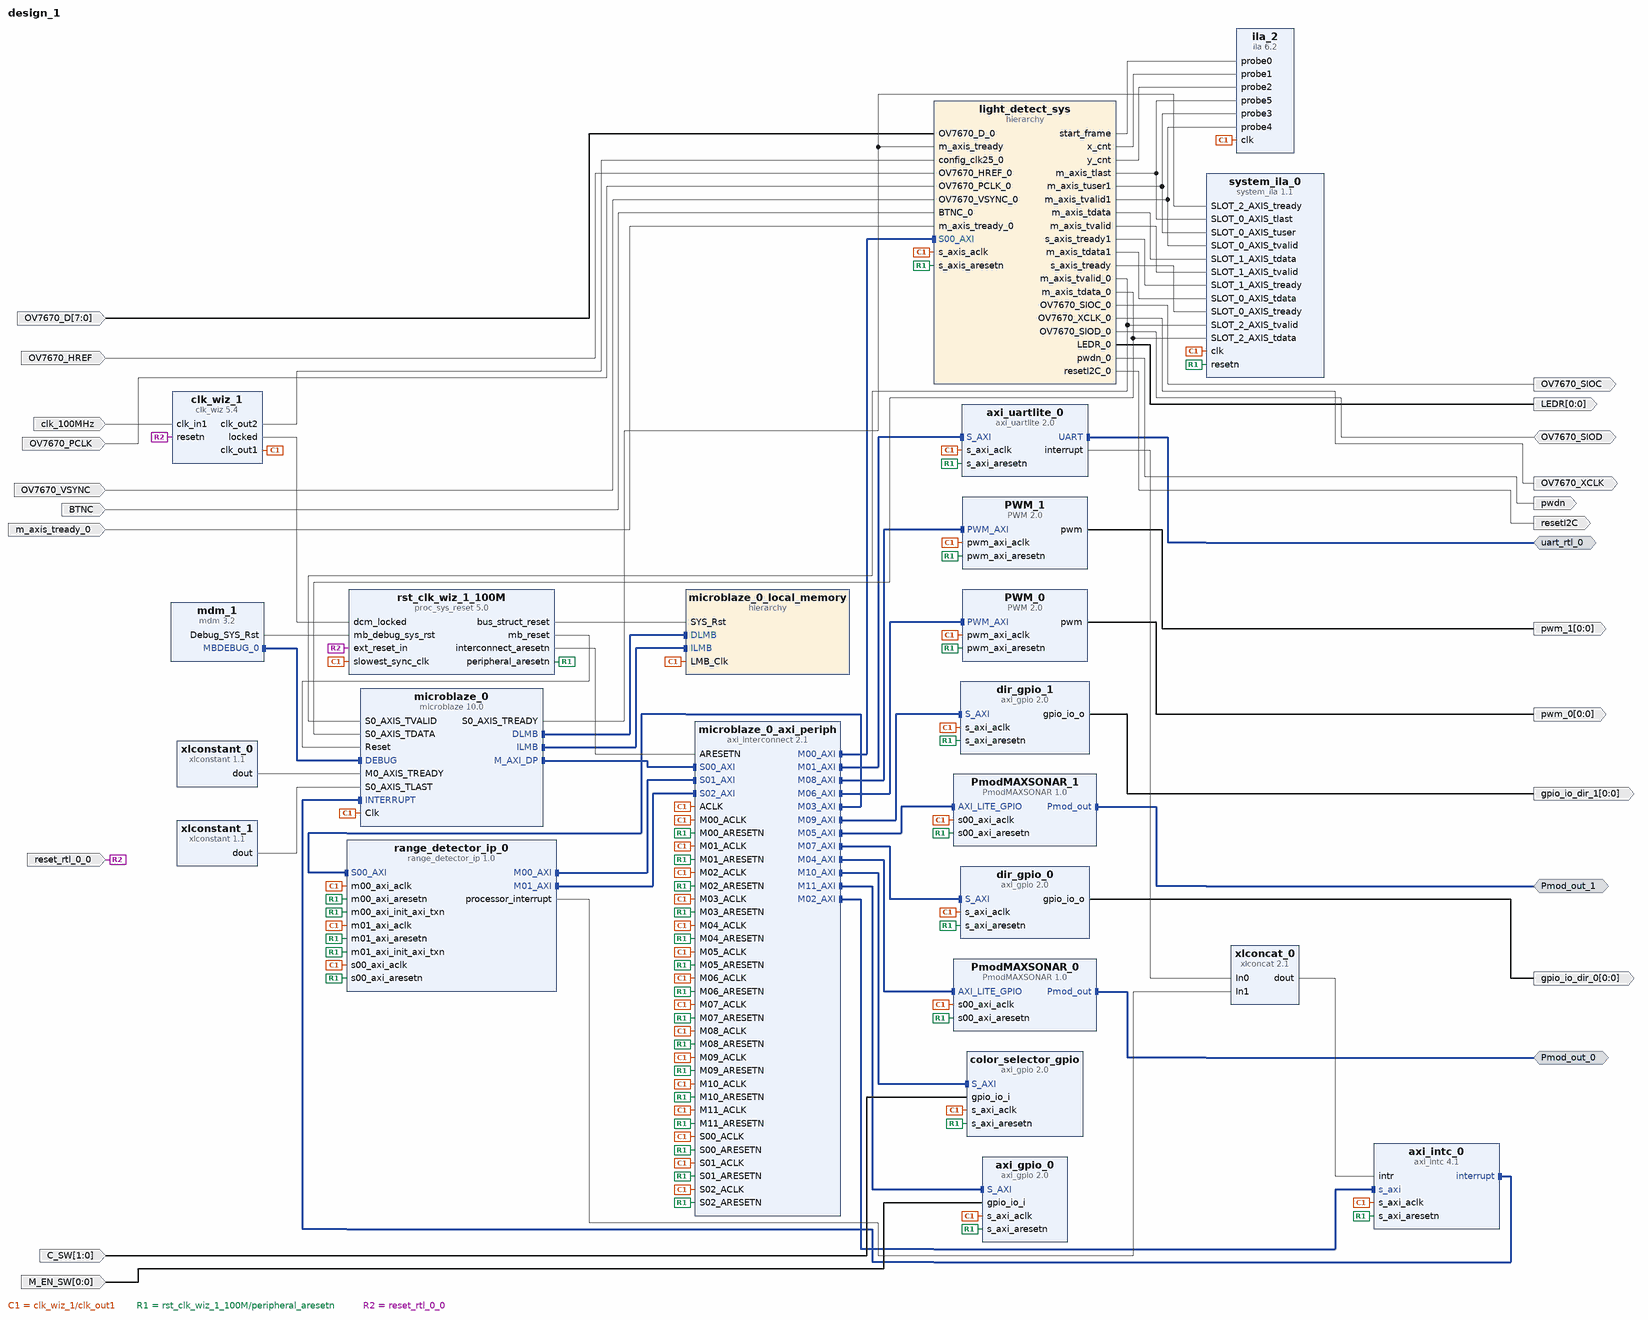
[diagram p0: block diagram of the top level]
# Vivado block design design_1, xc7a100tcsg324-1, Vivado 2017.4
create_bd_design design_1

create_bd_intf_port -mode Master -vlnv xilinx.com:interface:uart_rtl:1.0 uart_rtl_0
create_bd_intf_port -mode Master -vlnv digilentinc.com:interface:pmod_rtl:1.0 Pmod_out_0
create_bd_intf_port -mode Master -vlnv digilentinc.com:interface:pmod_rtl:1.0 Pmod_out_1
create_bd_port -dir I -type rst reset_rtl_0_0
set_property -dict {CONFIG.POLARITY ACTIVE_LOW} [get_bd_ports reset_rtl_0_0]
create_bd_port -dir I -from 7 -to 0 OV7670_D
create_bd_port -dir I OV7670_HREF
create_bd_port -dir I OV7670_PCLK
create_bd_port -dir I OV7670_VSYNC
create_bd_port -dir I BTNC
create_bd_port -dir O OV7670_XCLK
create_bd_port -dir O OV7670_SIOC
create_bd_port -dir IO OV7670_SIOD
create_bd_port -dir O pwdn
create_bd_port -dir O resetI2C
create_bd_port -dir O -from 0 -to 0 LEDR
create_bd_port -dir I -type clk clk_100MHz
set_property -dict {CONFIG.FREQ_HZ 100000000} [get_bd_ports clk_100MHz]
create_bd_port -dir I m_axis_tready_0
create_bd_port -dir O -from 0 -to 0 pwm_0
create_bd_port -dir O -from 0 -to 0 gpio_io_dir_0
create_bd_port -dir O -from 0 -to 0 pwm_1
create_bd_port -dir O -from 0 -to 0 gpio_io_dir_1
create_bd_port -dir I -from 1 -to 0 C_SW
create_bd_port -dir I -from 0 -to 0 M_EN_SW

create_bd_cell -type ip -vlnv xilinx.com:ip:microblaze:10.0 microblaze_0
set_property -dict [list \
  CONFIG.C_D_AXI 1 \
  CONFIG.C_D_LMB 1 \
  CONFIG.C_I_LMB 1 \
  CONFIG.C_USE_BARREL 1 \
  CONFIG.C_USE_DIV 1 \
  CONFIG.C_DEBUG_ENABLED 1 \
  CONFIG.C_FSL_LINKS 1 \
  CONFIG.C_USE_ICACHE 0 \
  CONFIG.C_ADDR_TAG_BITS 0 \
  CONFIG.C_USE_DCACHE 0 \
  CONFIG.C_DCACHE_ADDR_TAG 0 \
] [get_bd_cells microblaze_0]
create_bd_cell -type hier microblaze_0_local_memory
create_bd_cell -type ip -vlnv xilinx.com:ip:mdm:3.2 mdm_1
create_bd_cell -type ip -vlnv xilinx.com:ip:axi_interconnect:2.1 microblaze_0_axi_periph
set_property -dict {CONFIG.NUM_SI 3 CONFIG.NUM_MI 12} [get_bd_cells microblaze_0_axi_periph]
create_bd_cell -type hier light_detect_sys
create_bd_cell -type ip -vlnv xilinx.com:ip:xlconstant:1.1 xlconstant_0
create_bd_cell -type ip -vlnv xilinx.com:ip:xlconstant:1.1 xlconstant_1
set_property -dict {CONFIG.CONST_VAL 0} [get_bd_cells xlconstant_1]
create_bd_cell -type ip -vlnv xilinx.com:ip:system_ila:1.1 system_ila_0
set_property -dict [list \
  CONFIG.C_SLOT 0 \
  CONFIG.C_DATA_DEPTH 1024 \
  CONFIG.C_NUM_MONITOR_SLOTS 3 \
  CONFIG.C_SLOT_0_AXIS_TUSER_WIDTH 1 \
  CONFIG.C_SLOT_0_INTF_TYPE xilinx.com:interface:axis_rtl:1.0 \
  CONFIG.C_SLOT_1_INTF_TYPE xilinx.com:interface:axis_rtl:1.0 \
  CONFIG.C_SLOT_2_INTF_TYPE xilinx.com:interface:axis_rtl:1.0 \
] [get_bd_cells system_ila_0]
create_bd_cell -type ip -vlnv xilinx.com:ip:axi_intc:4.1 axi_intc_0
create_bd_cell -type ip -vlnv xilinx.com:ip:xlconcat:2.1 xlconcat_0
set_property -dict {CONFIG.NUM_PORTS 2} [get_bd_cells xlconcat_0]
create_bd_cell -type ip -vlnv xilinx.com:ip:axi_uartlite:2.0 axi_uartlite_0
create_bd_cell -type ip -vlnv xilinx.com:ip:clk_wiz:5.4 clk_wiz_1
set_property -dict [list \
  CONFIG.USE_INCLK_SWITCHOVER false \
  CONFIG.SECONDARY_IN_FREQ 100.000 \
  CONFIG.SECONDARY_SOURCE Single_ended_clock_capable_pin \
  CONFIG.CLKIN2_JITTER_PS 166.66 \
  CONFIG.CLKOUT2_USED true \
  CONFIG.NUM_OUT_CLKS 2 \
  CONFIG.CLKOUT2_REQUESTED_OUT_FREQ 25 \
  CONFIG.PRIM_SOURCE Single_ended_clock_capable_pin \
  CONFIG.RESET_PORT resetn \
  CONFIG.MMCM_DIVCLK_DIVIDE 1 \
  CONFIG.MMCM_CLKIN2_PERIOD 10.000 \
  CONFIG.MMCM_CLKOUT1_DIVIDE 40 \
  CONFIG.RESET_TYPE ACTIVE_LOW \
  CONFIG.CLKOUT2_JITTER 175.402 \
  CONFIG.CLKOUT2_PHASE_ERROR 98.575 \
] [get_bd_cells clk_wiz_1]
create_bd_cell -type ip -vlnv xilinx.com:ip:proc_sys_reset:5.0 rst_clk_wiz_1_100M
create_bd_cell -type ip -vlnv xilinx.com:ip:ila:6.2 ila_2
set_property -dict [list \
  CONFIG.C_PROBE2_WIDTH 12 \
  CONFIG.C_PROBE1_WIDTH 12 \
  CONFIG.C_DATA_DEPTH 8192 \
  CONFIG.C_NUM_OF_PROBES 6 \
  CONFIG.C_ENABLE_ILA_AXI_MON false \
  CONFIG.C_MONITOR_TYPE Native \
] [get_bd_cells ila_2]
create_bd_cell -type ip -vlnv digilentinc.com:IP:PmodMAXSONAR:1.0 PmodMAXSONAR_0
create_bd_cell -type ip -vlnv digilentinc.com:IP:PmodMAXSONAR:1.0 PmodMAXSONAR_1
create_bd_cell -type ip -vlnv digilentinc.com:IP:PWM:2.0 PWM_0
create_bd_cell -type ip -vlnv xilinx.com:ip:axi_gpio:2.0 dir_gpio_0
set_property -dict {CONFIG.C_GPIO_WIDTH 1 CONFIG.C_ALL_OUTPUTS 1} [get_bd_cells dir_gpio_0]
create_bd_cell -type ip -vlnv digilentinc.com:IP:PWM:2.0 PWM_1
create_bd_cell -type ip -vlnv xilinx.com:ip:axi_gpio:2.0 dir_gpio_1
set_property -dict {CONFIG.C_GPIO_WIDTH 1 CONFIG.C_ALL_OUTPUTS 1} [get_bd_cells dir_gpio_1]
create_bd_cell -type ip -vlnv user.org:user:range_detector_ip:1.0 range_detector_ip_0
create_bd_cell -type ip -vlnv xilinx.com:ip:axi_gpio:2.0 color_selector_gpio
set_property -dict {CONFIG.C_GPIO_WIDTH 2 CONFIG.C_ALL_INPUTS 1} [get_bd_cells color_selector_gpio]
create_bd_cell -type ip -vlnv xilinx.com:ip:axi_gpio:2.0 axi_gpio_0
set_property -dict {CONFIG.C_GPIO_WIDTH 1 CONFIG.C_ALL_INPUTS 1} [get_bd_cells axi_gpio_0]

# ---- hierarchy /microblaze_0_local_memory ----
current_bd_instance /microblaze_0_local_memory
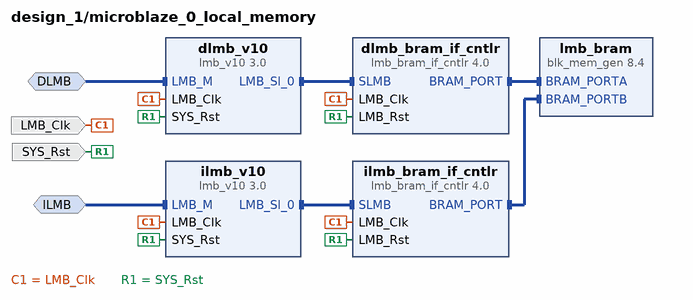
[diagram p1: block diagram inside /microblaze_0_local_memory]
create_bd_intf_pin -mode MirroredMaster -vlnv xilinx.com:interface:lmb_rtl:1.0 DLMB
create_bd_intf_pin -mode MirroredMaster -vlnv xilinx.com:interface:lmb_rtl:1.0 ILMB
create_bd_pin -dir I -type clk LMB_Clk
create_bd_pin -dir I -type rst SYS_Rst

create_bd_cell -type ip -vlnv xilinx.com:ip:lmb_v10:3.0 dlmb_v10
create_bd_cell -type ip -vlnv xilinx.com:ip:lmb_v10:3.0 ilmb_v10
create_bd_cell -type ip -vlnv xilinx.com:ip:lmb_bram_if_cntlr:4.0 dlmb_bram_if_cntlr
set_property -dict {CONFIG.C_ECC 0} [get_bd_cells dlmb_bram_if_cntlr]
create_bd_cell -type ip -vlnv xilinx.com:ip:lmb_bram_if_cntlr:4.0 ilmb_bram_if_cntlr
set_property -dict {CONFIG.C_ECC 0} [get_bd_cells ilmb_bram_if_cntlr]
create_bd_cell -type ip -vlnv xilinx.com:ip:blk_mem_gen:8.4 lmb_bram
set_property -dict {CONFIG.Memory_Type True_Dual_Port_RAM CONFIG.use_bram_block BRAM_Controller} [get_bd_cells lmb_bram]

# ---- hierarchy /light_detect_sys ----
current_bd_instance /light_detect_sys
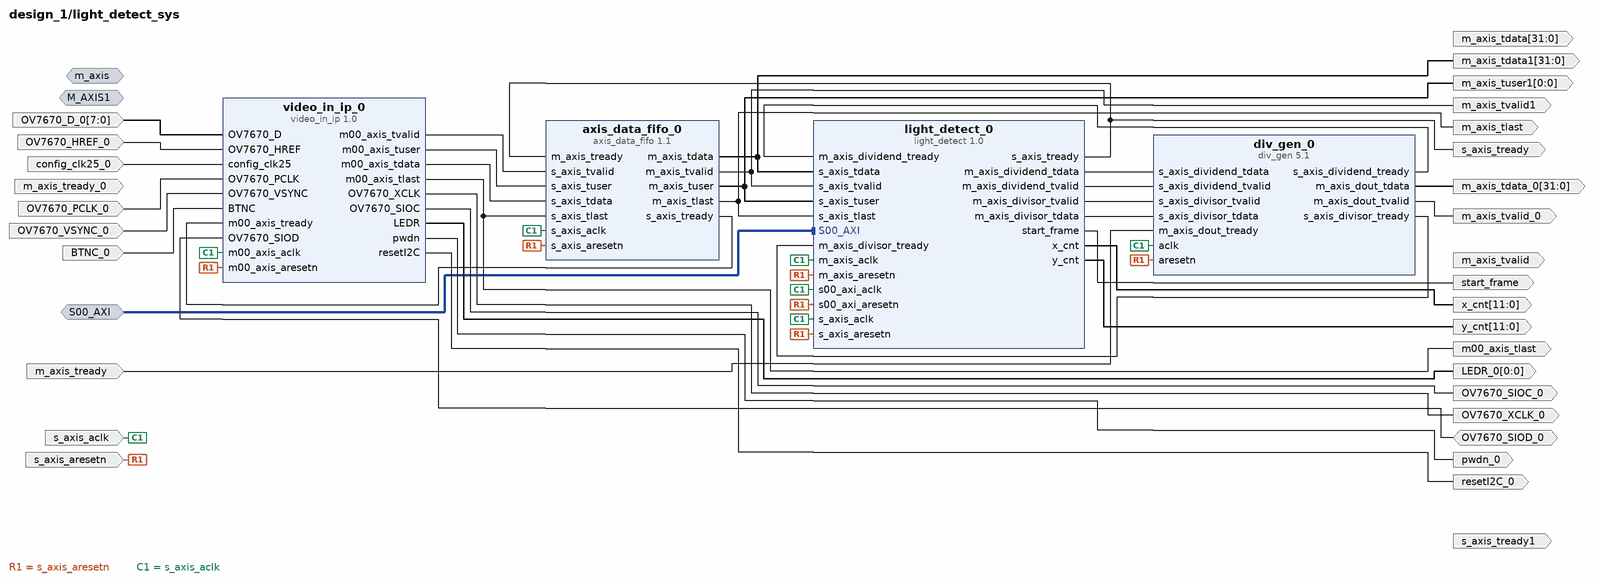
[diagram p2: block diagram inside /light_detect_sys]
create_bd_intf_pin -mode Slave -vlnv xilinx.com:interface:aximm_rtl:1.0 S00_AXI
create_bd_intf_pin -mode Monitor -vlnv xilinx.com:interface:axis_rtl:1.0 m_axis
create_bd_intf_pin -mode Monitor -vlnv xilinx.com:interface:axis_rtl:1.0 M_AXIS1
create_bd_pin -dir I -type rst s_axis_aresetn
create_bd_pin -dir I -type clk s_axis_aclk
create_bd_pin -dir I -from 7 -to 0 OV7670_D_0
create_bd_pin -dir I OV7670_HREF_0
create_bd_pin -dir I config_clk25_0
create_bd_pin -dir I OV7670_PCLK_0
create_bd_pin -dir I OV7670_VSYNC_0
create_bd_pin -dir I BTNC_0
create_bd_pin -dir O OV7670_XCLK_0
create_bd_pin -dir O OV7670_SIOC_0
create_bd_pin -dir IO OV7670_SIOD_0
create_bd_pin -dir O pwdn_0
create_bd_pin -dir O resetI2C_0
create_bd_pin -dir O -from 0 -to 0 LEDR_0
create_bd_pin -dir O -from 31 -to 0 m_axis_tdata1
create_bd_pin -dir O m_axis_tvalid1
create_bd_pin -dir O s_axis_tready
create_bd_pin -dir O m_axis_tvalid_0
create_bd_pin -dir I m_axis_tready_0
create_bd_pin -dir O -from 31 -to 0 m_axis_tdata_0
create_bd_pin -dir I m_axis_tready
create_bd_pin -dir O -from 31 -to 0 m_axis_tdata
create_bd_pin -dir O m_axis_tvalid
create_bd_pin -dir O s_axis_tready1
create_bd_pin -dir O m00_axis_tlast
create_bd_pin -dir O m_axis_tlast
create_bd_pin -dir O -from 0 -to 0 m_axis_tuser1
create_bd_pin -dir O start_frame
create_bd_pin -dir O -from 11 -to 0 x_cnt
create_bd_pin -dir O -from 11 -to 0 y_cnt

create_bd_cell -type ip -vlnv xilinx.com:ip:axis_data_fifo:1.1 axis_data_fifo_0
set_property -dict {CONFIG.TDATA_NUM_BYTES 4 CONFIG.TUSER_WIDTH 1 CONFIG.HAS_TLAST 1} [get_bd_cells axis_data_fifo_0]
create_bd_cell -type ip -vlnv xilinx.com:user:video_in_ip:1.0 video_in_ip_0
create_bd_cell -type ip -vlnv xilinx.com:ip:div_gen:5.1 div_gen_0
set_property -dict [list \
  CONFIG.algorithm_type High_Radix \
  CONFIG.dividend_and_quotient_width 32 \
  CONFIG.divisor_width 32 \
  CONFIG.remainder_type Fractional \
  CONFIG.fractional_width 0 \
  CONFIG.operand_sign Signed \
  CONFIG.clocks_per_division 1 \
  CONFIG.divide_by_zero_detect true \
  CONFIG.FlowControl Blocking \
  CONFIG.OutTready true \
  CONFIG.latency 29 \
  CONFIG.ARESETN true \
] [get_bd_cells div_gen_0]
create_bd_cell -type ip -vlnv user.org:user:light_detect:1.0 light_detect_0

# ---- connections ----

current_bd_instance /microblaze_0_local_memory
connect_bd_intf_net -intf_net microblaze_0_dlmb_bus [get_bd_intf_pins dlmb_v10/LMB_Sl_0] [get_bd_intf_pins dlmb_bram_if_cntlr/SLMB]
connect_bd_intf_net -intf_net microblaze_0_ilmb_bus [get_bd_intf_pins ilmb_v10/LMB_Sl_0] [get_bd_intf_pins ilmb_bram_if_cntlr/SLMB]
connect_bd_intf_net -intf_net microblaze_0_dlmb_cntlr [get_bd_intf_pins dlmb_bram_if_cntlr/BRAM_PORT] [get_bd_intf_pins lmb_bram/BRAM_PORTA]
connect_bd_intf_net -intf_net microblaze_0_ilmb_cntlr [get_bd_intf_pins ilmb_bram_if_cntlr/BRAM_PORT] [get_bd_intf_pins lmb_bram/BRAM_PORTB]
connect_bd_intf_net -intf_net microblaze_0_dlmb [get_bd_intf_pins DLMB] [get_bd_intf_pins dlmb_v10/LMB_M]
connect_bd_intf_net -intf_net microblaze_0_ilmb [get_bd_intf_pins ILMB] [get_bd_intf_pins ilmb_v10/LMB_M]
connect_bd_net -net microblaze_0_Clk [get_bd_pins LMB_Clk] \
  [get_bd_pins dlmb_v10/LMB_Clk] [get_bd_pins dlmb_bram_if_cntlr/LMB_Clk] [get_bd_pins ilmb_v10/LMB_Clk] \
  [get_bd_pins ilmb_bram_if_cntlr/LMB_Clk]
connect_bd_net [get_bd_pins SYS_Rst] \
  [get_bd_pins dlmb_v10/SYS_Rst] [get_bd_pins dlmb_bram_if_cntlr/LMB_Rst] [get_bd_pins ilmb_v10/SYS_Rst] \
  [get_bd_pins ilmb_bram_if_cntlr/LMB_Rst]

current_bd_instance /light_detect_sys
connect_bd_intf_net [get_bd_intf_pins S00_AXI] [get_bd_intf_pins light_detect_0/S00_AXI]
# interface net Conn2 has one end: m_axis
# interface net Conn3 has one end: M_AXIS1
connect_bd_net -net rst_clk_wiz_1_100M_peripheral_aresetn [get_bd_pins s_axis_aresetn] \
  [get_bd_pins axis_data_fifo_0/s_axis_aresetn] [get_bd_pins video_in_ip_0/m00_axis_aresetn] [get_bd_pins div_gen_0/aresetn] \
  [get_bd_pins light_detect_0/s_axis_aresetn] [get_bd_pins light_detect_0/m_axis_aresetn] \
  [get_bd_pins light_detect_0/s00_axi_aresetn]
connect_bd_net -net microblaze_0_Clk [get_bd_pins s_axis_aclk] \
  [get_bd_pins axis_data_fifo_0/s_axis_aclk] [get_bd_pins video_in_ip_0/m00_axis_aclk] [get_bd_pins div_gen_0/aclk] \
  [get_bd_pins light_detect_0/s_axis_aclk] [get_bd_pins light_detect_0/m_axis_aclk] [get_bd_pins light_detect_0/s00_axi_aclk]
connect_bd_net -net OV7670_D_0_1 [get_bd_pins OV7670_D_0] [get_bd_pins video_in_ip_0/OV7670_D]
connect_bd_net -net OV7670_HREF_0_1 [get_bd_pins OV7670_HREF_0] [get_bd_pins video_in_ip_0/OV7670_HREF]
connect_bd_net -net config_clk25_0_1 [get_bd_pins config_clk25_0] [get_bd_pins video_in_ip_0/config_clk25]
connect_bd_net -net OV7670_PCLK_0_1 [get_bd_pins OV7670_PCLK_0] [get_bd_pins video_in_ip_0/OV7670_PCLK]
connect_bd_net -net OV7670_VSYNC_0_1 [get_bd_pins OV7670_VSYNC_0] [get_bd_pins video_in_ip_0/OV7670_VSYNC]
connect_bd_net -net BTNC_0_1 [get_bd_pins BTNC_0] [get_bd_pins video_in_ip_0/BTNC]
connect_bd_net -net video_in_ip_v1_0_0_m00_axis_tlast [get_bd_pins video_in_ip_0/m00_axis_tlast] \
  [get_bd_pins m00_axis_tlast] [get_bd_pins axis_data_fifo_0/s_axis_tlast]
connect_bd_net [get_bd_pins axis_data_fifo_0/m_axis_tdata] [get_bd_pins m_axis_tdata1] [get_bd_pins light_detect_0/s_axis_tdata]
connect_bd_net [get_bd_pins axis_data_fifo_0/m_axis_tvalid] [get_bd_pins m_axis_tvalid1] [get_bd_pins light_detect_0/s_axis_tvalid]
connect_bd_net [get_bd_pins light_detect_0/s_axis_tready] [get_bd_pins s_axis_tready] [get_bd_pins axis_data_fifo_0/m_axis_tready]
connect_bd_net [get_bd_pins axis_data_fifo_0/m_axis_tuser] [get_bd_pins m_axis_tuser1] [get_bd_pins light_detect_0/s_axis_tuser]
connect_bd_net [get_bd_pins m_axis_tready] [get_bd_pins div_gen_0/m_axis_dout_tready]
connect_bd_net [get_bd_pins axis_data_fifo_0/m_axis_tlast] [get_bd_pins m_axis_tlast] [get_bd_pins light_detect_0/s_axis_tlast]
connect_bd_net [get_bd_pins light_detect_0/start_frame] [get_bd_pins start_frame]
connect_bd_net [get_bd_pins light_detect_0/x_cnt] [get_bd_pins x_cnt]
connect_bd_net [get_bd_pins light_detect_0/y_cnt] [get_bd_pins y_cnt]
connect_bd_net [get_bd_pins video_in_ip_0/OV7670_XCLK] [get_bd_pins OV7670_XCLK_0]
connect_bd_net [get_bd_pins video_in_ip_0/OV7670_SIOC] [get_bd_pins OV7670_SIOC_0]
connect_bd_net [get_bd_pins OV7670_SIOD_0] [get_bd_pins video_in_ip_0/OV7670_SIOD]
connect_bd_net [get_bd_pins video_in_ip_0/pwdn] [get_bd_pins pwdn_0]
connect_bd_net [get_bd_pins video_in_ip_0/resetI2C] [get_bd_pins resetI2C_0]
connect_bd_net [get_bd_pins video_in_ip_0/LEDR] [get_bd_pins LEDR_0]
connect_bd_net [get_bd_pins video_in_ip_0/m00_axis_tvalid] [get_bd_pins axis_data_fifo_0/s_axis_tvalid]
connect_bd_net [get_bd_pins axis_data_fifo_0/s_axis_tready] [get_bd_pins video_in_ip_0/m00_axis_tready]
connect_bd_net [get_bd_pins video_in_ip_0/m00_axis_tuser] [get_bd_pins axis_data_fifo_0/s_axis_tuser]
connect_bd_net [get_bd_pins video_in_ip_0/m00_axis_tdata] [get_bd_pins axis_data_fifo_0/s_axis_tdata]
connect_bd_net [get_bd_pins light_detect_0/m_axis_dividend_tdata] [get_bd_pins div_gen_0/s_axis_dividend_tdata]
connect_bd_net [get_bd_pins light_detect_0/m_axis_dividend_tvalid] [get_bd_pins div_gen_0/s_axis_dividend_tvalid]
connect_bd_net [get_bd_pins div_gen_0/s_axis_dividend_tready] [get_bd_pins light_detect_0/m_axis_dividend_tready]
connect_bd_net [get_bd_pins light_detect_0/m_axis_divisor_tvalid] [get_bd_pins div_gen_0/s_axis_divisor_tvalid]
connect_bd_net [get_bd_pins div_gen_0/s_axis_divisor_tready] [get_bd_pins light_detect_0/m_axis_divisor_tready]
connect_bd_net [get_bd_pins light_detect_0/m_axis_divisor_tdata] [get_bd_pins div_gen_0/s_axis_divisor_tdata]
connect_bd_net [get_bd_pins div_gen_0/m_axis_dout_tdata] [get_bd_pins m_axis_tdata_0]
connect_bd_net [get_bd_pins div_gen_0/m_axis_dout_tvalid] [get_bd_pins m_axis_tvalid_0]

current_bd_instance /
connect_bd_intf_net [get_bd_intf_pins microblaze_0/DLMB] [get_bd_intf_pins microblaze_0_local_memory/DLMB]
connect_bd_intf_net [get_bd_intf_pins microblaze_0/ILMB] [get_bd_intf_pins microblaze_0_local_memory/ILMB]
connect_bd_intf_net [get_bd_intf_pins mdm_1/MBDEBUG_0] [get_bd_intf_pins microblaze_0/DEBUG]
connect_bd_intf_net [get_bd_intf_pins microblaze_0/M_AXI_DP] [get_bd_intf_pins microblaze_0_axi_periph/S00_AXI]
connect_bd_intf_net [get_bd_intf_pins microblaze_0_axi_periph/M00_AXI] [get_bd_intf_pins light_detect_sys/S00_AXI]
connect_bd_intf_net [get_bd_intf_pins microblaze_0_axi_periph/M01_AXI] [get_bd_intf_pins axi_uartlite_0/S_AXI]
connect_bd_intf_net [get_bd_intf_pins microblaze_0_axi_periph/M02_AXI] [get_bd_intf_pins axi_intc_0/s_axi]
connect_bd_intf_net [get_bd_intf_pins axi_intc_0/interrupt] [get_bd_intf_pins microblaze_0/INTERRUPT]
connect_bd_intf_net [get_bd_intf_pins microblaze_0_axi_periph/M03_AXI] [get_bd_intf_pins range_detector_ip_0/S00_AXI]
connect_bd_intf_net [get_bd_intf_pins range_detector_ip_0/M00_AXI] [get_bd_intf_pins microblaze_0_axi_periph/S01_AXI]
connect_bd_intf_net [get_bd_intf_pins range_detector_ip_0/M01_AXI] [get_bd_intf_pins microblaze_0_axi_periph/S02_AXI]
connect_bd_intf_net [get_bd_intf_pins microblaze_0_axi_periph/M04_AXI] [get_bd_intf_pins PmodMAXSONAR_0/AXI_LITE_GPIO]
connect_bd_intf_net [get_bd_intf_pins microblaze_0_axi_periph/M05_AXI] [get_bd_intf_pins PmodMAXSONAR_1/AXI_LITE_GPIO]
connect_bd_intf_net [get_bd_intf_pins microblaze_0_axi_periph/M06_AXI] [get_bd_intf_pins PWM_0/PWM_AXI]
connect_bd_intf_net [get_bd_intf_pins microblaze_0_axi_periph/M07_AXI] [get_bd_intf_pins dir_gpio_0/S_AXI]
connect_bd_intf_net [get_bd_intf_pins microblaze_0_axi_periph/M08_AXI] [get_bd_intf_pins PWM_1/PWM_AXI]
connect_bd_intf_net [get_bd_intf_pins microblaze_0_axi_periph/M09_AXI] [get_bd_intf_pins dir_gpio_1/S_AXI]
connect_bd_intf_net [get_bd_intf_pins microblaze_0_axi_periph/M10_AXI] [get_bd_intf_pins color_selector_gpio/S_AXI]
connect_bd_intf_net [get_bd_intf_pins microblaze_0_axi_periph/M11_AXI] [get_bd_intf_pins axi_gpio_0/S_AXI]
connect_bd_intf_net [get_bd_intf_ports uart_rtl_0] [get_bd_intf_pins axi_uartlite_0/UART]
connect_bd_intf_net [get_bd_intf_ports Pmod_out_0] [get_bd_intf_pins PmodMAXSONAR_0/Pmod_out]
connect_bd_intf_net [get_bd_intf_ports Pmod_out_1] [get_bd_intf_pins PmodMAXSONAR_1/Pmod_out]
connect_bd_net -net microblaze_0_Clk [get_bd_pins clk_wiz_1/clk_out1] \
  [get_bd_pins microblaze_0/Clk] [get_bd_pins system_ila_0/clk] [get_bd_pins axi_intc_0/s_axi_aclk] \
  [get_bd_pins axi_uartlite_0/s_axi_aclk] [get_bd_pins rst_clk_wiz_1_100M/slowest_sync_clk] [get_bd_pins ila_2/clk] \
  [get_bd_pins PmodMAXSONAR_0/s00_axi_aclk] [get_bd_pins PmodMAXSONAR_1/s00_axi_aclk] [get_bd_pins PWM_0/pwm_axi_aclk] \
  [get_bd_pins dir_gpio_0/s_axi_aclk] [get_bd_pins PWM_1/pwm_axi_aclk] [get_bd_pins dir_gpio_1/s_axi_aclk] \
  [get_bd_pins range_detector_ip_0/s00_axi_aclk] [get_bd_pins range_detector_ip_0/m00_axi_aclk] \
  [get_bd_pins range_detector_ip_0/m01_axi_aclk] [get_bd_pins microblaze_0_local_memory/LMB_Clk] \
  [get_bd_pins microblaze_0_axi_periph/S00_ACLK] [get_bd_pins microblaze_0_axi_periph/M00_ACLK] \
  [get_bd_pins microblaze_0_axi_periph/ACLK] [get_bd_pins light_detect_sys/s_axis_aclk] \
  [get_bd_pins microblaze_0_axi_periph/M01_ACLK] [get_bd_pins microblaze_0_axi_periph/M02_ACLK] \
  [get_bd_pins microblaze_0_axi_periph/M03_ACLK] [get_bd_pins microblaze_0_axi_periph/S01_ACLK] \
  [get_bd_pins microblaze_0_axi_periph/S02_ACLK] [get_bd_pins microblaze_0_axi_periph/M04_ACLK] \
  [get_bd_pins microblaze_0_axi_periph/M05_ACLK] [get_bd_pins microblaze_0_axi_periph/M06_ACLK] \
  [get_bd_pins microblaze_0_axi_periph/M07_ACLK] [get_bd_pins microblaze_0_axi_periph/M08_ACLK] \
  [get_bd_pins microblaze_0_axi_periph/M09_ACLK] [get_bd_pins color_selector_gpio/s_axi_aclk] \
  [get_bd_pins microblaze_0_axi_periph/M10_ACLK] [get_bd_pins axi_gpio_0/s_axi_aclk] \
  [get_bd_pins microblaze_0_axi_periph/M11_ACLK]
connect_bd_net [get_bd_pins clk_wiz_1/locked] [get_bd_pins rst_clk_wiz_1_100M/dcm_locked]
connect_bd_net [get_bd_pins rst_clk_wiz_1_100M/mb_reset] [get_bd_pins microblaze_0/Reset]
connect_bd_net [get_bd_pins rst_clk_wiz_1_100M/bus_struct_reset] [get_bd_pins microblaze_0_local_memory/SYS_Rst]
connect_bd_net [get_bd_pins mdm_1/Debug_SYS_Rst] [get_bd_pins rst_clk_wiz_1_100M/mb_debug_sys_rst]
connect_bd_net [get_bd_pins rst_clk_wiz_1_100M/peripheral_aresetn] \
  [get_bd_pins system_ila_0/resetn] [get_bd_pins axi_intc_0/s_axi_aresetn] [get_bd_pins axi_uartlite_0/s_axi_aresetn] \
  [get_bd_pins PmodMAXSONAR_0/s00_axi_aresetn] [get_bd_pins PmodMAXSONAR_1/s00_axi_aresetn] \
  [get_bd_pins PWM_0/pwm_axi_aresetn] [get_bd_pins dir_gpio_0/s_axi_aresetn] [get_bd_pins PWM_1/pwm_axi_aresetn] \
  [get_bd_pins dir_gpio_1/s_axi_aresetn] [get_bd_pins range_detector_ip_0/s00_axi_aresetn] \
  [get_bd_pins range_detector_ip_0/m00_axi_aresetn] [get_bd_pins range_detector_ip_0/m00_axi_init_axi_txn] \
  [get_bd_pins range_detector_ip_0/m01_axi_aresetn] [get_bd_pins range_detector_ip_0/m01_axi_init_axi_txn] \
  [get_bd_pins microblaze_0_axi_periph/S00_ARESETN] [get_bd_pins microblaze_0_axi_periph/M00_ARESETN] \
  [get_bd_pins light_detect_sys/s_axis_aresetn] [get_bd_pins microblaze_0_axi_periph/M01_ARESETN] \
  [get_bd_pins microblaze_0_axi_periph/M02_ARESETN] [get_bd_pins microblaze_0_axi_periph/M03_ARESETN] \
  [get_bd_pins microblaze_0_axi_periph/S01_ARESETN] [get_bd_pins microblaze_0_axi_periph/S02_ARESETN] \
  [get_bd_pins microblaze_0_axi_periph/M04_ARESETN] [get_bd_pins microblaze_0_axi_periph/M05_ARESETN] \
  [get_bd_pins microblaze_0_axi_periph/M06_ARESETN] [get_bd_pins microblaze_0_axi_periph/M07_ARESETN] \
  [get_bd_pins microblaze_0_axi_periph/M08_ARESETN] [get_bd_pins microblaze_0_axi_periph/M09_ARESETN] \
  [get_bd_pins color_selector_gpio/s_axi_aresetn] [get_bd_pins microblaze_0_axi_periph/M10_ARESETN] \
  [get_bd_pins axi_gpio_0/s_axi_aresetn] [get_bd_pins microblaze_0_axi_periph/M11_ARESETN]
connect_bd_net [get_bd_pins rst_clk_wiz_1_100M/interconnect_aresetn] [get_bd_pins microblaze_0_axi_periph/ARESETN]
connect_bd_net -net reset_rtl_0_0_1 [get_bd_ports reset_rtl_0_0] [get_bd_pins clk_wiz_1/resetn] [get_bd_pins rst_clk_wiz_1_100M/ext_reset_in]
connect_bd_net -net OV7670_D_0_1 [get_bd_ports OV7670_D] [get_bd_pins light_detect_sys/OV7670_D_0]
connect_bd_net -net OV7670_HREF_0_1 [get_bd_ports OV7670_HREF] [get_bd_pins light_detect_sys/OV7670_HREF_0]
connect_bd_net -net OV7670_PCLK_0_1 [get_bd_ports OV7670_PCLK] [get_bd_pins light_detect_sys/OV7670_PCLK_0]
connect_bd_net -net OV7670_VSYNC_0_1 [get_bd_ports OV7670_VSYNC] [get_bd_pins light_detect_sys/OV7670_VSYNC_0]
connect_bd_net -net BTNC_0_1 [get_bd_ports BTNC] [get_bd_pins light_detect_sys/BTNC_0]
connect_bd_net [get_bd_pins light_detect_sys/OV7670_XCLK_0] [get_bd_ports OV7670_XCLK]
connect_bd_net [get_bd_pins light_detect_sys/OV7670_SIOC_0] [get_bd_ports OV7670_SIOC]
connect_bd_net [get_bd_ports OV7670_SIOD] [get_bd_pins light_detect_sys/OV7670_SIOD_0]
connect_bd_net [get_bd_pins light_detect_sys/pwdn_0] [get_bd_ports pwdn]
connect_bd_net [get_bd_pins light_detect_sys/resetI2C_0] [get_bd_ports resetI2C]
connect_bd_net [get_bd_pins light_detect_sys/LEDR_0] [get_bd_ports LEDR]
connect_bd_net [get_bd_ports clk_100MHz] [get_bd_pins clk_wiz_1/clk_in1]
connect_bd_net -net config_clk25_0_1 [get_bd_pins clk_wiz_1/clk_out2] [get_bd_pins light_detect_sys/config_clk25_0]
connect_bd_net [get_bd_pins xlconstant_0/dout] [get_bd_pins microblaze_0/M0_AXIS_TREADY]
connect_bd_net [get_bd_pins light_detect_sys/m_axis_tvalid_0] [get_bd_pins microblaze_0/S0_AXIS_TVALID] [get_bd_pins system_ila_0/SLOT_2_AXIS_tvalid]
connect_bd_net -net m_axis_tready_0_1 [get_bd_ports m_axis_tready_0] [get_bd_pins light_detect_sys/m_axis_tready_0]
connect_bd_net [get_bd_pins microblaze_0/S0_AXIS_TREADY] [get_bd_pins system_ila_0/SLOT_2_AXIS_tready] [get_bd_pins light_detect_sys/m_axis_tready]
connect_bd_net [get_bd_pins xlconstant_1/dout] [get_bd_pins microblaze_0/S0_AXIS_TLAST]
connect_bd_net [get_bd_pins light_detect_sys/m_axis_tdata] [get_bd_pins system_ila_0/SLOT_1_AXIS_tdata]
connect_bd_net [get_bd_pins light_detect_sys/m_axis_tvalid] [get_bd_pins system_ila_0/SLOT_1_AXIS_tvalid]
connect_bd_net [get_bd_pins light_detect_sys/s_axis_tready1] [get_bd_pins system_ila_0/SLOT_1_AXIS_tready]
connect_bd_net [get_bd_pins light_detect_sys/m_axis_tdata_0] [get_bd_pins microblaze_0/S0_AXIS_TDATA] [get_bd_pins system_ila_0/SLOT_2_AXIS_tdata]
connect_bd_net [get_bd_pins xlconcat_0/dout] [get_bd_pins axi_intc_0/intr]
connect_bd_net [get_bd_pins axi_uartlite_0/interrupt] [get_bd_pins xlconcat_0/In0]
connect_bd_net [get_bd_pins range_detector_ip_0/processor_interrupt] [get_bd_pins xlconcat_0/In1]
connect_bd_net [get_bd_pins light_detect_sys/m_axis_tdata1] [get_bd_pins system_ila_0/SLOT_0_AXIS_tdata]
connect_bd_net [get_bd_pins light_detect_sys/m_axis_tlast] [get_bd_pins system_ila_0/SLOT_0_AXIS_tlast] [get_bd_pins ila_2/probe5]
connect_bd_net [get_bd_pins light_detect_sys/m_axis_tuser1] [get_bd_pins system_ila_0/SLOT_0_AXIS_tuser] [get_bd_pins ila_2/probe3]
connect_bd_net [get_bd_pins light_detect_sys/m_axis_tvalid1] [get_bd_pins system_ila_0/SLOT_0_AXIS_tvalid] [get_bd_pins ila_2/probe4]
connect_bd_net [get_bd_pins light_detect_sys/s_axis_tready] [get_bd_pins system_ila_0/SLOT_0_AXIS_tready]
connect_bd_net [get_bd_pins light_detect_sys/start_frame] [get_bd_pins ila_2/probe0]
connect_bd_net [get_bd_pins light_detect_sys/x_cnt] [get_bd_pins ila_2/probe1]
connect_bd_net [get_bd_pins light_detect_sys/y_cnt] [get_bd_pins ila_2/probe2]
connect_bd_net [get_bd_pins PWM_0/pwm] [get_bd_ports pwm_0]
connect_bd_net [get_bd_pins dir_gpio_0/gpio_io_o] [get_bd_ports gpio_io_dir_0]
connect_bd_net [get_bd_pins PWM_1/pwm] [get_bd_ports pwm_1]
connect_bd_net [get_bd_pins dir_gpio_1/gpio_io_o] [get_bd_ports gpio_io_dir_1]
connect_bd_net -net gpio_io_i_0_1 [get_bd_ports C_SW] [get_bd_pins color_selector_gpio/gpio_io_i]
connect_bd_net -net gpio_io_i_0_2 [get_bd_ports M_EN_SW] [get_bd_pins axi_gpio_0/gpio_io_i]

# ---- address map ----
assign_bd_address -offset 0x00000000 -range 256K -target_address_space [get_bd_addr_spaces microblaze_0/Data] [get_bd_addr_segs microblaze_0_local_memory/dlmb_bram_if_cntlr/SLMB/Mem]
assign_bd_address -offset 0x00040000 -range 4K -target_address_space [get_bd_addr_spaces microblaze_0/Data] [get_bd_addr_segs PmodMAXSONAR_0/AXI_LITE_GPIO/Reg0]
assign_bd_address -offset 0x00050000 -range 4K -target_address_space [get_bd_addr_spaces microblaze_0/Data] [get_bd_addr_segs PmodMAXSONAR_1/AXI_LITE_GPIO/Reg0]
assign_bd_address -offset 0x40000000 -range 64K -target_address_space [get_bd_addr_spaces microblaze_0/Data] [get_bd_addr_segs dir_gpio_0/S_AXI/Reg]
assign_bd_address -offset 0x40010000 -range 64K -target_address_space [get_bd_addr_spaces microblaze_0/Data] [get_bd_addr_segs dir_gpio_1/S_AXI/Reg]
assign_bd_address -offset 0x40020000 -range 64K -target_address_space [get_bd_addr_spaces microblaze_0/Data] [get_bd_addr_segs color_selector_gpio/S_AXI/Reg]
assign_bd_address -offset 0x40030000 -range 64K -target_address_space [get_bd_addr_spaces microblaze_0/Data] [get_bd_addr_segs axi_gpio_0/S_AXI/Reg]
assign_bd_address -offset 0x40600000 -range 64K -target_address_space [get_bd_addr_spaces microblaze_0/Data] [get_bd_addr_segs axi_uartlite_0/S_AXI/Reg]
assign_bd_address -offset 0x41200000 -range 64K -target_address_space [get_bd_addr_spaces microblaze_0/Data] [get_bd_addr_segs axi_intc_0/S_AXI/Reg]
assign_bd_address -offset 0x44A00000 -range 64K -target_address_space [get_bd_addr_spaces microblaze_0/Data] [get_bd_addr_segs light_detect_sys/light_detect_0/S00_AXI/S00_AXI_reg]
assign_bd_address -offset 0x44A10000 -range 64K -target_address_space [get_bd_addr_spaces microblaze_0/Data] [get_bd_addr_segs range_detector_ip_0/S00_AXI/S00_AXI_reg]
assign_bd_address -offset 0x44A20000 -range 64K -target_address_space [get_bd_addr_spaces microblaze_0/Data] [get_bd_addr_segs PWM_0/PWM_AXI/PWM_AXI_reg]
assign_bd_address -offset 0x44A30000 -range 64K -target_address_space [get_bd_addr_spaces microblaze_0/Data] [get_bd_addr_segs PWM_1/PWM_AXI/PWM_AXI_reg]
assign_bd_address -offset 0x00000000 -range 64K -target_address_space [get_bd_addr_spaces microblaze_0/Instruction] [get_bd_addr_segs microblaze_0_local_memory/ilmb_bram_if_cntlr/SLMB/Mem]
assign_bd_address -offset 0x00040000 -range 4K -target_address_space [get_bd_addr_spaces range_detector_ip_0/M00_AXI] [get_bd_addr_segs PmodMAXSONAR_0/AXI_LITE_GPIO/Reg0]
assign_bd_address -offset 0x40000000 -range 64K -target_address_space [get_bd_addr_spaces range_detector_ip_0/M00_AXI] [get_bd_addr_segs dir_gpio_0/S_AXI/Reg]
assign_bd_address -offset 0x40010000 -range 64K -target_address_space [get_bd_addr_spaces range_detector_ip_0/M00_AXI] [get_bd_addr_segs dir_gpio_1/S_AXI/Reg]
assign_bd_address -offset 0x40020000 -range 64K -target_address_space [get_bd_addr_spaces range_detector_ip_0/M00_AXI] [get_bd_addr_segs color_selector_gpio/S_AXI/Reg]
assign_bd_address -offset 0x40030000 -range 64K -target_address_space [get_bd_addr_spaces range_detector_ip_0/M00_AXI] [get_bd_addr_segs axi_gpio_0/S_AXI/Reg]
assign_bd_address -offset 0x44A20000 -range 64K -target_address_space [get_bd_addr_spaces range_detector_ip_0/M00_AXI] [get_bd_addr_segs PWM_0/PWM_AXI/PWM_AXI_reg]
assign_bd_address -offset 0x44A30000 -range 64K -target_address_space [get_bd_addr_spaces range_detector_ip_0/M00_AXI] [get_bd_addr_segs PWM_1/PWM_AXI/PWM_AXI_reg]
exclude_bd_addr_seg -offset 0x40600000 -range 64K -target_address_space [get_bd_addr_spaces range_detector_ip_0/M00_AXI] [get_bd_addr_segs axi_uartlite_0/S_AXI/Reg]
exclude_bd_addr_seg -offset 0x41200000 -range 64K -target_address_space [get_bd_addr_spaces range_detector_ip_0/M00_AXI] [get_bd_addr_segs axi_intc_0/S_AXI/Reg]
exclude_bd_addr_seg -offset 0x44A00000 -range 64K -target_address_space [get_bd_addr_spaces range_detector_ip_0/M00_AXI] [get_bd_addr_segs light_detect_sys/light_detect_0/S00_AXI/S00_AXI_reg]
exclude_bd_addr_seg -offset 0x44A10000 -range 64K -target_address_space [get_bd_addr_spaces range_detector_ip_0/M00_AXI] [get_bd_addr_segs range_detector_ip_0/S00_AXI/S00_AXI_reg]
assign_bd_address -offset 0x00050000 -range 4K -target_address_space [get_bd_addr_spaces range_detector_ip_0/M01_AXI] [get_bd_addr_segs PmodMAXSONAR_1/AXI_LITE_GPIO/Reg0]
assign_bd_address -offset 0x40000000 -range 64K -target_address_space [get_bd_addr_spaces range_detector_ip_0/M01_AXI] [get_bd_addr_segs dir_gpio_0/S_AXI/Reg]
assign_bd_address -offset 0x40010000 -range 64K -target_address_space [get_bd_addr_spaces range_detector_ip_0/M01_AXI] [get_bd_addr_segs dir_gpio_1/S_AXI/Reg]
assign_bd_address -offset 0x40020000 -range 64K -target_address_space [get_bd_addr_spaces range_detector_ip_0/M01_AXI] [get_bd_addr_segs color_selector_gpio/S_AXI/Reg]
assign_bd_address -offset 0x40030000 -range 64K -target_address_space [get_bd_addr_spaces range_detector_ip_0/M01_AXI] [get_bd_addr_segs axi_gpio_0/S_AXI/Reg]
assign_bd_address -offset 0x44A20000 -range 64K -target_address_space [get_bd_addr_spaces range_detector_ip_0/M01_AXI] [get_bd_addr_segs PWM_0/PWM_AXI/PWM_AXI_reg]
assign_bd_address -offset 0x44A30000 -range 64K -target_address_space [get_bd_addr_spaces range_detector_ip_0/M01_AXI] [get_bd_addr_segs PWM_1/PWM_AXI/PWM_AXI_reg]
exclude_bd_addr_seg -offset 0x40600000 -range 64K -target_address_space [get_bd_addr_spaces range_detector_ip_0/M01_AXI] [get_bd_addr_segs axi_uartlite_0/S_AXI/Reg]
exclude_bd_addr_seg -offset 0x41200000 -range 64K -target_address_space [get_bd_addr_spaces range_detector_ip_0/M01_AXI] [get_bd_addr_segs axi_intc_0/S_AXI/Reg]
exclude_bd_addr_seg -offset 0x44A00000 -range 64K -target_address_space [get_bd_addr_spaces range_detector_ip_0/M01_AXI] [get_bd_addr_segs light_detect_sys/light_detect_0/S00_AXI/S00_AXI_reg]
exclude_bd_addr_seg -offset 0x44A10000 -range 64K -target_address_space [get_bd_addr_spaces range_detector_ip_0/M01_AXI] [get_bd_addr_segs range_detector_ip_0/S00_AXI/S00_AXI_reg]

validate_bd_design
save_bd_design
